# EAGLE schematic MotionDetectorCamera (EAGLE 9.6.2)

## Sheet 1 of 7: Power
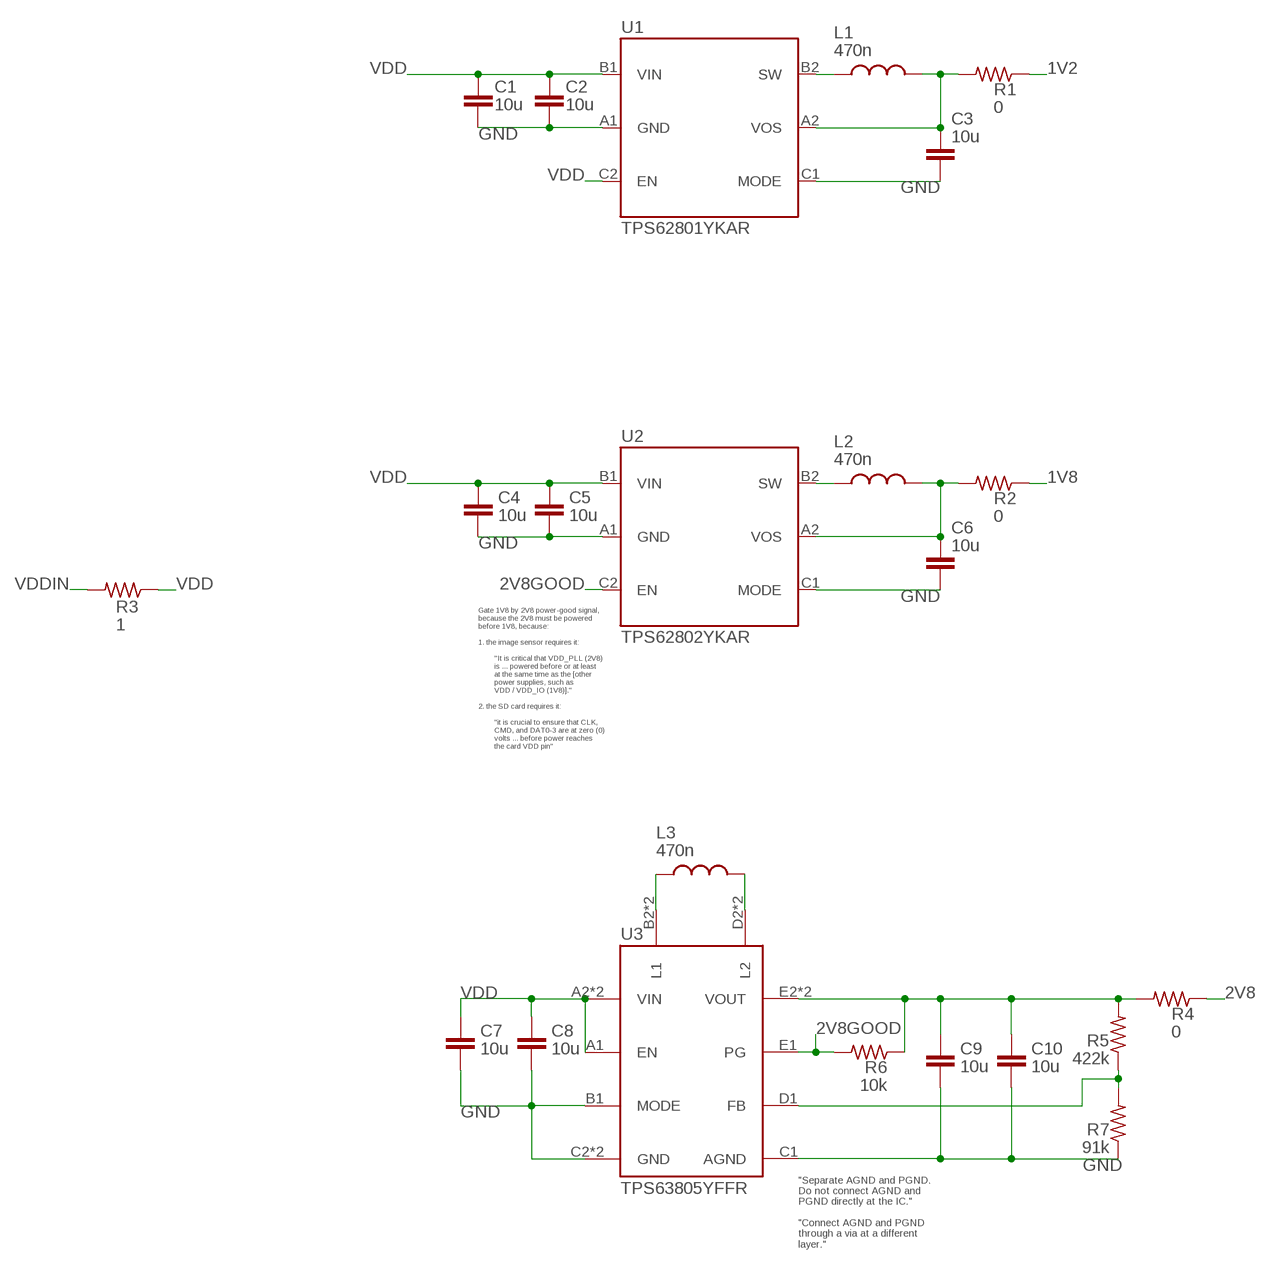
[diagram p0: schematic, sheet 1]

### Parts
C1  10u  CAPACITOR0805  [0805]
C2  10u  CAPACITOR0805  [0805]
C3  10u  CAPACITOR0805  [0805]
C4  10u  CAPACITOR0805  [0805]
C5  10u  CAPACITOR0805  [0805]
C6  10u  CAPACITOR0805  [0805]
C7  10u  CAPACITOR0805  [0805]
C8  10u  CAPACITOR0805  [0805]
C9  10u  CAPACITOR0805  [0805]
C10  10u  CAPACITOR0805  [0805]
L1  470n  INDUCTOR0806  [0806]
L2  470n  INDUCTOR0806  [0806]
L3  470n  INDUCTOR0806  [0806]
R1  0  RESISTOR0805  [0805]
R2  0  RESISTOR0805  [0805]
R3  1  RESISTOR1206  [1206]
R4  0  RESISTOR0805  [0805]
R5  422k  RESISTOR0402  [0402]
R6  10k  RESISTOR0402  [0402]
R7  91k  RESISTOR0402  [0402]
U1  TI-TPS6280XYKAR  [TI-TPS6280XYKAR]
U2  TI-TPS6280XYKAR  [TI-TPS6280XYKAR]
U3  TI-TPS63805YFFR  [TI-TPS63805YFFR]

### Nets
1V2: R1.1 ; also sheet 2
1V8: R2.1 ; also sheet 2,3,4,5,6
2V8: R4.1 ; also sheet 2,3,5
2V8GOOD: R6.2 U2.C2(EN) U3.E1(PG)
GND: C1.2 C2.2 C3.2 C4.2 C5.2 C6.2 C7.2 C8.2 C9.2 C10.2 R7.1 U1.A1(GND) U1.C1(MODE) U2.A1(GND) U2.C1(MODE) U3.B1(MODE) U3.C1(AGND) U3.C2(GND) U3.C3(GND) ; also sheet 2,3,4,5,6,7
N$4: L2.1 U2.B2(SW)
N$5: L1.1 U1.B2(SW)
N$8: C6.1 L2.2 R2.2 U2.A2(VOS)
N$11: R5.1 R7.2 U3.D1(FB)
N$12: L3.1 U3.B2(L1) U3.B3(L1)
N$13: L3.2 U3.D2(L2) U3.D3(L2)
N$16: C3.1 L1.2 R1.2 U1.A2(VOS)
N$18: C9.1 C10.1 R4.2 R5.2 R6.1 U3.E2(VOUT) U3.E3(VOUT)
VDD: C1.1 C2.1 C4.1 C5.1 C7.1 C8.1 R3.1 U1.B1(VIN) U1.C2(EN) U2.B1(VIN) U3.A1(EN) U3.A2(VIN) U3.A3(VIN)
VDDIN: R3.2 ; also sheet 6,7

### Notes on the sheet
- Gate 1V8 by 2V8 power-good signal,
  because the 2V8 must be powered
  before 1V8, because:
  
  1. the image sensor requires it:
  
          "It is critical that VDD_PLL (2V8)
          is ... powered before or at least
          at the same time as the [other
          power supplies, such as
          VDD / VDD_IO (1V8)]."
  
  2. the SD card requires it:
  
          "it is crucial to ensure that CLK,
          CMD, and DAT0-3 are at zero (0)
          volts ... before power reaches
          the card VDD pin"
- "Separate AGND and PGND.
  Do not connect AGND and
  PGND directly at the IC."
  
  "Connect AGND and PGND
  through a via at a different
  layer."

## Sheet 2 of 7: ICE40
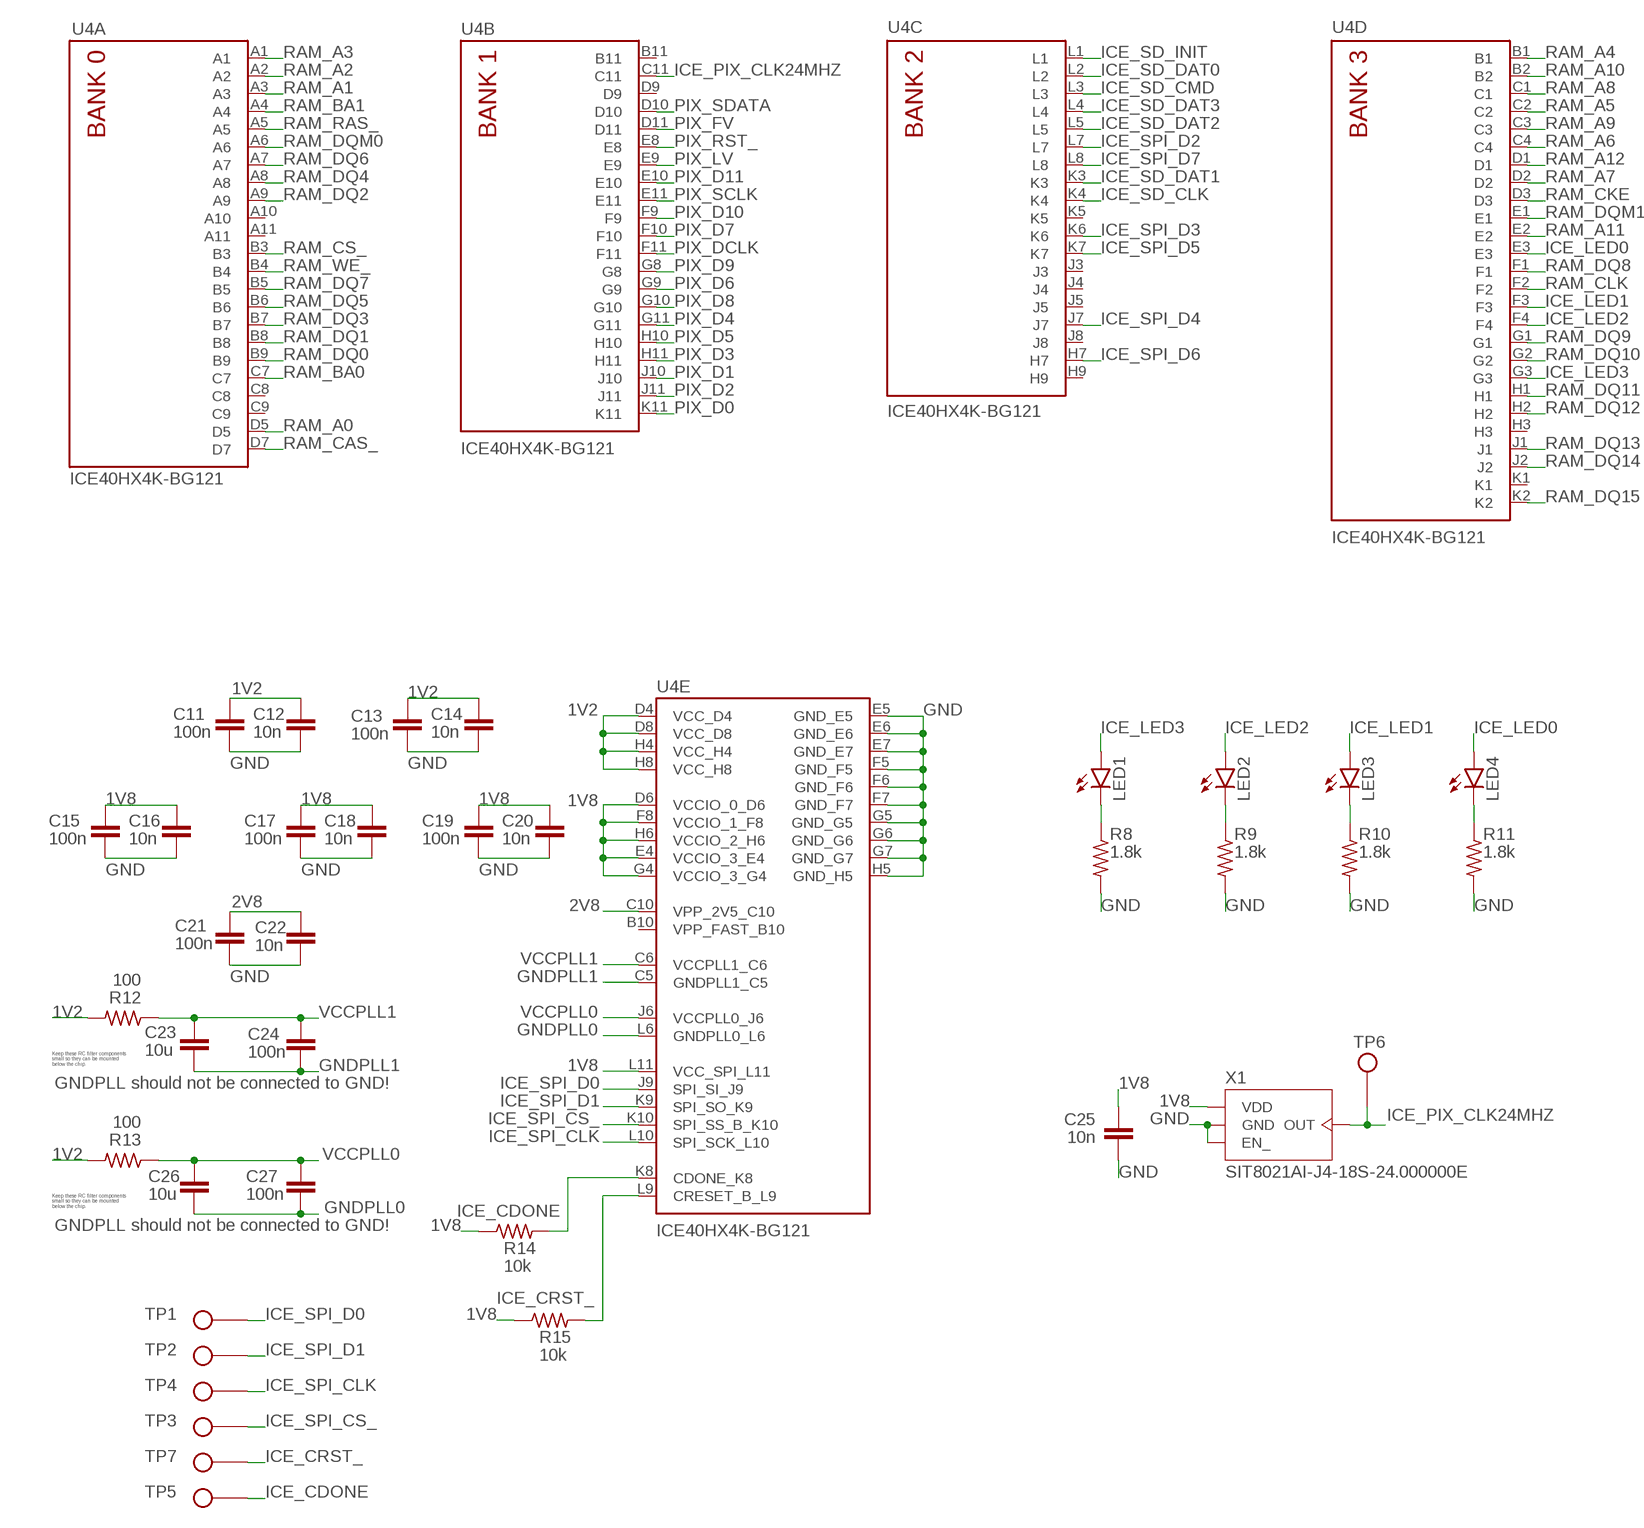
[diagram p1: schematic, sheet 2]

### Parts
C11  100n  CAPACITOR0402  [0402]
C12  10n  CAPACITOR0402  [0402]
C13  100n  CAPACITOR0402  [0402]
C14  10n  CAPACITOR0402  [0402]
C15  100n  CAPACITOR0402  [0402]
C16  10n  CAPACITOR0402  [0402]
C17  100n  CAPACITOR0402  [0402]
C18  10n  CAPACITOR0402  [0402]
C19  100n  CAPACITOR0402  [0402]
C20  10n  CAPACITOR0402  [0402]
C21  100n  CAPACITOR0402  [0402]
C22  10n  CAPACITOR0402  [0402]
C23  10u  CAPACITOR0805  [0805]
C24  100n  CAPACITOR0402  [0402]
C25  10n  CAPACITOR0402  [0402]
C26  10u  CAPACITOR0805  [0805]
C27  100n  CAPACITOR0402  [0402]
LED1  LED  [LED-0603]
LED2  LED  [LED-0603]
LED3  LED  [LED-0603]
LED4  LED  [LED-0603]
R8  1.8k  RESISTOR0402  [0402]
R9  1.8k  RESISTOR0402  [0402]
R10  1.8k  RESISTOR0402  [0402]
R11  1.8k  RESISTOR0402  [0402]
R12  100  RESISTOR0402  [0402]
R13  100  RESISTOR0402  [0402]
R14  10k  RESISTOR0402  [0402]
R15  10k  RESISTOR0402  [0402]
TP1  TEST-POINT  [TEST-POINT]
TP2  TEST-POINT  [TEST-POINT]
TP3  TEST-POINT  [TEST-POINT]
TP4  TEST-POINT  [TEST-POINT]
TP5  TEST-POINT  [TEST-POINT]
TP6  TEST-POINT  [TEST-POINT]
TP7  TEST-POINT  [TEST-POINT]
U4  LATTICE-ICE40HX4K-BG121  [LATTICE-ICE40HX4K-BG121]
X1  SITIME-SIT8021  [SITIME-SIT8021]

### Nets
1V2: C11.1 C12.1 C13.1 C14.1 R12.2 R13.2 U4.D4(E:VCC_D4) U4.D8(E:VCC_D8) U4.H4(E:VCC_H4) U4.H8(E:VCC_H8) ; also sheet 1
1V8: C15.1 C16.1 C17.1 C18.1 C19.1 C20.1 C25.1 R14.1 R15.1 U4.D6(E:VCCIO_0_D6) U4.E4(E:VCCIO_3_E4) U4.F8(E:VCCIO_1_F8) U4.G4(E:VCCIO_3_G4) U4.H6(E:VCCIO_2_H6) U4.L11(E:VCC_SPI_L11) X1.3(VDD) ; also sheet 1,3,4,5,6
2V8: C21.1 C22.1 U4.C10(E:VPP_2V5_C10) ; also sheet 1,3,5
GND: C11.2 C12.2 C13.2 C14.2 C15.2 C16.2 C17.2 C18.2 C19.2 C20.2 C21.2 C22.2 C25.2 R8.2 R9.2 R10.2 R11.2 U4.E5(E:GND_E5) U4.E6(E:GND_E6) U4.E7(E:GND_E7) U4.F5(E:GND_F5) U4.F6(E:GND_F6) U4.F7(E:GND_F7) U4.G5(E:GND_G5) U4.G6(E:GND_G6) U4.G7(E:GND_G7) U4.H5(E:GND_H5) X1.1(EN_) X1.4(GND) ; also sheet 1,3,4,5,6,7
GNDPLL0: C26.2 C27.2 U4.L6(E:GNDPLL0_L6)
GNDPLL1: C23.2 C24.2 U4.C5(E:GNDPLL1_C5)
ICE_CDONE: R14.2 TP5.X U4.K8(E:CDONE_K8) ; also sheet 6
ICE_CRST_: R15.2 TP7.X U4.L9(E:CRESET_B_L9) ; also sheet 6
ICE_LED0: LED4.A U4.E3(D:E3)
ICE_LED1: LED3.A U4.F3(D:F3)
ICE_LED2: LED2.A U4.F4(D:F4)
ICE_LED3: LED1.A U4.G3(D:G3)
ICE_PIX_CLK24MHZ: TP6.X U4.C11(B:C11) X1.2(OUT) ; also sheet 3
ICE_SD_CLK: U4.K4(C:K4) ; also sheet 5
ICE_SD_CMD: U4.L3(C:L3) ; also sheet 5
ICE_SD_DAT0: U4.L2(C:L2) ; also sheet 5
ICE_SD_DAT1: U4.K3(C:K3) ; also sheet 5
ICE_SD_DAT2: U4.L5(C:L5) ; also sheet 5
ICE_SD_DAT3: U4.L4(C:L4) ; also sheet 5
ICE_SD_INIT: U4.L1(C:L1) ; also sheet 5
ICE_SPI_CLK: TP4.X U4.L10(E:SPI_SCK_L10) ; also sheet 6
ICE_SPI_CS_: TP3.X U4.K10(E:SPI_SS_B_K10) ; also sheet 6
ICE_SPI_D0: TP1.X U4.J9(E:SPI_SI_J9) ; also sheet 6
ICE_SPI_D1: TP2.X U4.K9(E:SPI_SO_K9) ; also sheet 6
ICE_SPI_D2: U4.L7(C:L7) ; also sheet 6
ICE_SPI_D3: U4.K6(C:K6) ; also sheet 6
ICE_SPI_D4: U4.J7(C:J7) ; also sheet 6
ICE_SPI_D5: U4.K7(C:K7) ; also sheet 6
ICE_SPI_D6: U4.H7(C:H7) ; also sheet 6
ICE_SPI_D7: U4.L8(C:L8) ; also sheet 6
N$23: LED4.C R11.1
N$26: LED3.C R10.1
N$29: LED2.C R9.1
N$31: LED1.C R8.1
PIX_D0: U4.K11(B:K11) ; also sheet 3
PIX_D1: U4.J10(B:J10) ; also sheet 3
PIX_D2: U4.J11(B:J11) ; also sheet 3
PIX_D3: U4.H11(B:H11) ; also sheet 3
PIX_D4: U4.G11(B:G11) ; also sheet 3
PIX_D5: U4.H10(B:H10) ; also sheet 3
PIX_D6: U4.G9(B:G9) ; also sheet 3
PIX_D7: U4.F10(B:F10) ; also sheet 3
PIX_D8: U4.G10(B:G10) ; also sheet 3
PIX_D9: U4.G8(B:G8) ; also sheet 3
PIX_D10: U4.F9(B:F9) ; also sheet 3
PIX_D11: U4.E10(B:E10) ; also sheet 3
PIX_DCLK: U4.F11(B:F11) ; also sheet 3
PIX_FV: U4.D11(B:D11) ; also sheet 3
PIX_LV: U4.E9(B:E9) ; also sheet 3
PIX_RST_: U4.E8(B:E8) ; also sheet 3
PIX_SCLK: U4.E11(B:E11) ; also sheet 3
PIX_SDATA: U4.D10(B:D10) ; also sheet 3
RAM_A0: U4.D5(A:D5) ; also sheet 4
RAM_A1: U4.A3(A:A3) ; also sheet 4
RAM_A2: U4.A2(A:A2) ; also sheet 4
RAM_A3: U4.A1(A:A1) ; also sheet 4
RAM_A4: U4.B1(D:B1) ; also sheet 4
RAM_A5: U4.C2(D:C2) ; also sheet 4
RAM_A6: U4.C4(D:C4) ; also sheet 4
RAM_A7: U4.D2(D:D2) ; also sheet 4
RAM_A8: U4.C1(D:C1) ; also sheet 4
RAM_A9: U4.C3(D:C3) ; also sheet 4
RAM_A10: U4.B2(D:B2) ; also sheet 4
RAM_A11: U4.E2(D:E2) ; also sheet 4
RAM_A12: U4.D1(D:D1) ; also sheet 4
RAM_BA0: U4.C7(A:C7) ; also sheet 4
RAM_BA1: U4.A4(A:A4) ; also sheet 4
RAM_CAS_: U4.D7(A:D7) ; also sheet 4
RAM_CKE: U4.D3(D:D3) ; also sheet 4
RAM_CLK: U4.F2(D:F2) ; also sheet 4
RAM_CS_: U4.B3(A:B3) ; also sheet 4
RAM_DQ0: U4.B9(A:B9) ; also sheet 4
RAM_DQ1: U4.B8(A:B8) ; also sheet 4
RAM_DQ2: U4.A9(A:A9) ; also sheet 4
RAM_DQ3: U4.B7(A:B7) ; also sheet 4
RAM_DQ4: U4.A8(A:A8) ; also sheet 4
RAM_DQ5: U4.B6(A:B6) ; also sheet 4
RAM_DQ6: U4.A7(A:A7) ; also sheet 4
RAM_DQ7: U4.B5(A:B5) ; also sheet 4
RAM_DQ8: U4.F1(D:F1) ; also sheet 4
RAM_DQ9: U4.G1(D:G1) ; also sheet 4
RAM_DQ10: U4.G2(D:G2) ; also sheet 4
RAM_DQ11: U4.H1(D:H1) ; also sheet 4
RAM_DQ12: U4.H2(D:H2) ; also sheet 4
RAM_DQ13: U4.J1(D:J1) ; also sheet 4
RAM_DQ14: U4.J2(D:J2) ; also sheet 4
RAM_DQ15: U4.K2(D:K2) ; also sheet 4
RAM_DQM0: U4.A6(A:A6) ; also sheet 4
RAM_DQM1: U4.E1(D:E1) ; also sheet 4
RAM_RAS_: U4.A5(A:A5) ; also sheet 4
RAM_WE_: U4.B4(A:B4) ; also sheet 4
VCCPLL0: C26.1 C27.1 R13.1 U4.J6(E:VCCPLL0_J6)
VCCPLL1: C23.1 C24.1 R12.1 U4.C6(E:VCCPLL1_C6)
Unconnected: U4.A10(A:A10) U4.A11(A:A11) U4.B10(E:VPP_FAST_B10) U4.B11(B:B11) U4.C8(A:C8) U4.C9(A:C9) U4.D9(B:D9) U4.H3(D:H3) U4.H9(C:H9) U4.J3(C:J3) U4.J4(C:J4) U4.J5(C:J5) U4.J8(C:J8) U4.K1(D:K1) U4.K5(C:K5)

### Notes on the sheet
- Keep these RC filter components
  small so they can be mounted
  below the chip.
- GNDPLL should not be connected to GND!
- Keep these RC filter components
  small so they can be mounted
  below the chip.
- GNDPLL should not be connected to GND!

## Sheet 3 of 7: Image Sensor
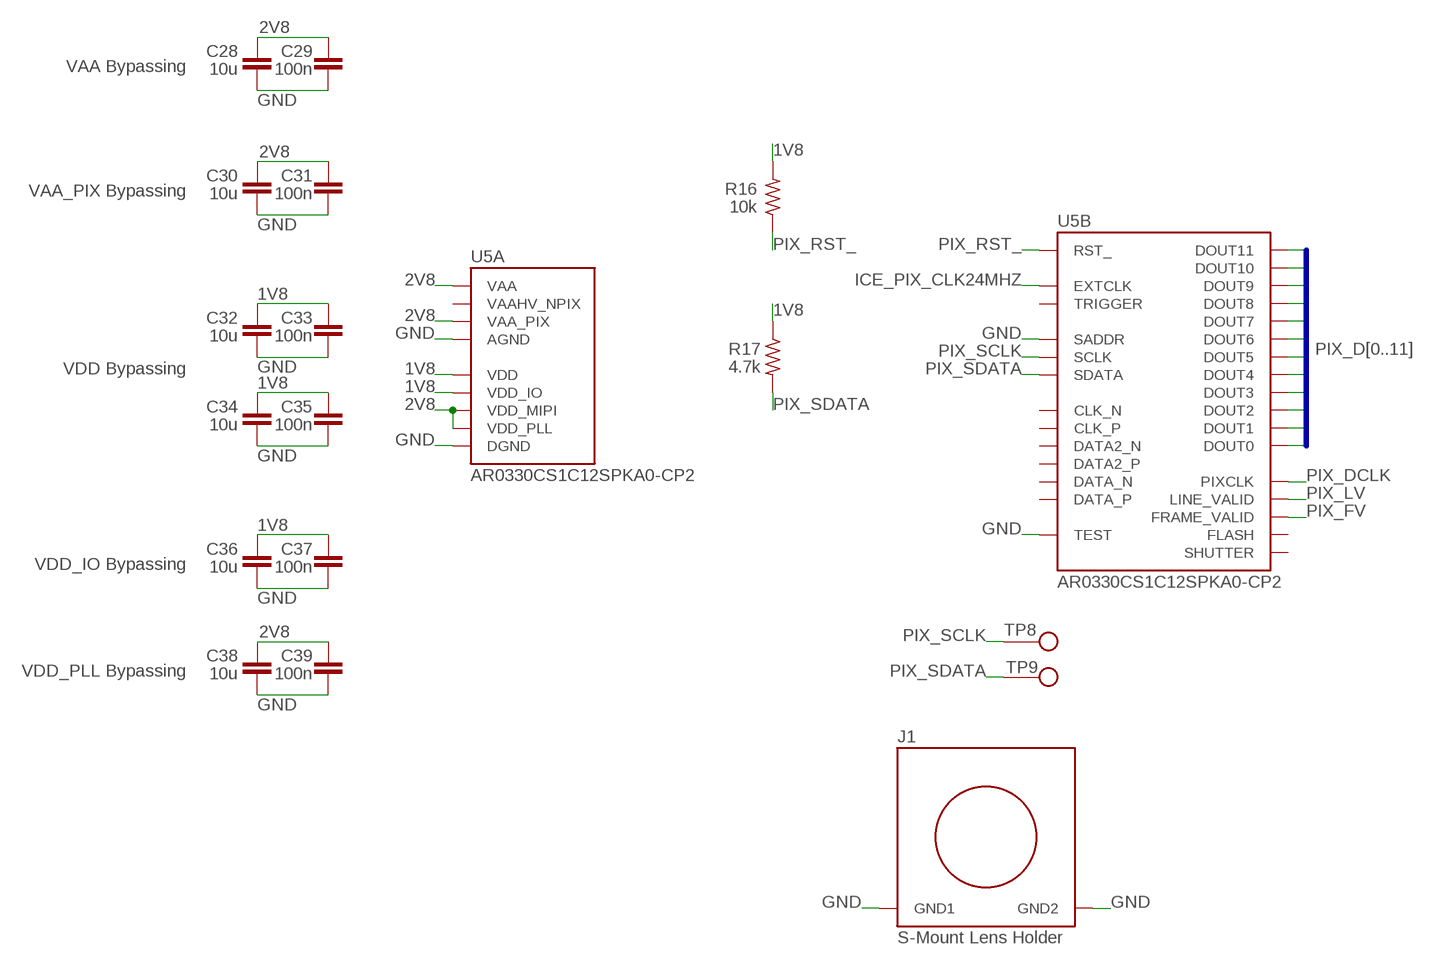
[diagram p2: schematic, sheet 3]

### Parts
C28  10u  CAPACITOR0805  [0805]
C29  100n  CAPACITOR0402  [0402]
C30  10u  CAPACITOR0805  [0805]
C31  100n  CAPACITOR0402  [0402]
C32  10u  CAPACITOR0805  [0805]
C33  100n  CAPACITOR0402  [0402]
C34  10u  CAPACITOR0805  [0805]
C35  100n  CAPACITOR0402  [0402]
C36  10u  CAPACITOR0805  [0805]
C37  100n  CAPACITOR0402  [0402]
C38  10u  CAPACITOR0805  [0805]
C39  100n  CAPACITOR0402  [0402]
J1  S-MOUNT-LENS-HOLDER  [S-MOUNT-LENS-HOLDER]
R16  10k  RESISTOR0402  [0402]
R17  4.7k  RESISTOR0402  [0402]
TP8  TEST-POINT  [TEST-POINT]
TP9  TEST-POINT  [TEST-POINT]
U5  ON-AR0330CS1C12SPKA0  [ON-AR0330CS1C12SPKA0]

### Nets
1V8: C32.1 C33.1 C34.1 C35.1 C36.1 C37.1 R16.2 R17.1 U5.A7(A:VDD_IO) U5.A8(A:VDD) U5.B1(A:VDD) U5.D2(A:VDD_IO) U5.D5(A:VDD_IO) U5.D6(A:VDD_IO) U5.E5(A:VDD_IO) U5.F6(A:VDD_IO) U5.G2(A:VDD) U5.G8(A:VDD) U5.H5(A:VDD_IO) ; also sheet 1,2,4,5,6
2V8: C28.1 C29.1 C30.1 C31.1 C38.1 C39.1 U5.A1(A:VAA) U5.A5(A:VAA_PIX) U5.A6(A:VAA) U5.F8(A:VDD_PLL) U5.H6(A:VDD_MIPI) U5.H8(A:VDD_MIPI) ; also sheet 1,2,5
GND: C28.2 C29.2 C30.2 C31.2 C32.2 C33.2 C34.2 C35.2 C36.2 C37.2 C38.2 C39.2 J1.1(GND1) J1.2(GND2) U5.A3(A:AGND) U5.B4(A:DGND) U5.B5(A:AGND) U5.B6(A:DGND) U5.B7(B:TEST) U5.C1(B:SADDR) U5.C4(A:DGND) U5.C5(A:DGND) U5.C6(A:DGND) U5.D4(A:DGND) U5.E6(A:DGND) U5.G1(A:DGND) U5.H2(A:DGND) U5.H3(A:DGND) ; also sheet 1,2,4,5,6,7
ICE_PIX_CLK24MHZ: U5.D7(B:EXTCLK) ; also sheet 2
PIX_D0: U5.G6(B:DOUT0) ; also sheet 2
PIX_D1: U5.G5(B:DOUT1) ; also sheet 2
PIX_D2: U5.H4(B:DOUT2) ; also sheet 2
PIX_D3: U5.G4(B:DOUT3) ; also sheet 2
PIX_D4: U5.F5(B:DOUT4) ; also sheet 2
PIX_D5: U5.G3(B:DOUT5) ; also sheet 2
PIX_D6: U5.F4(B:DOUT6) ; also sheet 2
PIX_D7: U5.E4(B:DOUT7) ; also sheet 2
PIX_D8: U5.F3(B:DOUT8) ; also sheet 2
PIX_D9: U5.E3(B:DOUT9) ; also sheet 2
PIX_D10: U5.D3(B:DOUT10) ; also sheet 2
PIX_D11: U5.E2(B:DOUT11) ; also sheet 2
PIX_DCLK: U5.E1(B:PIXCLK) ; also sheet 2
PIX_FV: U5.B3(B:FRAME_VALID) ; also sheet 2
PIX_LV: U5.C3(B:LINE_VALID) ; also sheet 2
PIX_RST_: R16.1 U5.C8(B:RST_) ; also sheet 2
PIX_SCLK: TP8.X U5.D1(B:SCLK) ; also sheet 2
PIX_SDATA: R17.2 TP9.X U5.B2(B:SDATA) ; also sheet 2
Unconnected: U5.A2(A:VAAHV_NPIX) U5.B8(B:SHUTTER) U5.C2(B:FLASH) U5.C7(B:TRIGGER) U5.D8(B:DATA_N) U5.E7(B:CLK_N) U5.E8(B:DATA_P) U5.F7(B:CLK_P) U5.G7(B:DATA2_N) U5.H7(B:DATA2_P)

### Buses
PIX_D[0..11]

### Notes on the sheet
- VAA Bypassing
- VAA_PIX Bypassing
- VDD Bypassing
- VDD_IO Bypassing
- VDD_PLL Bypassing

## Sheet 4 of 7: RAM
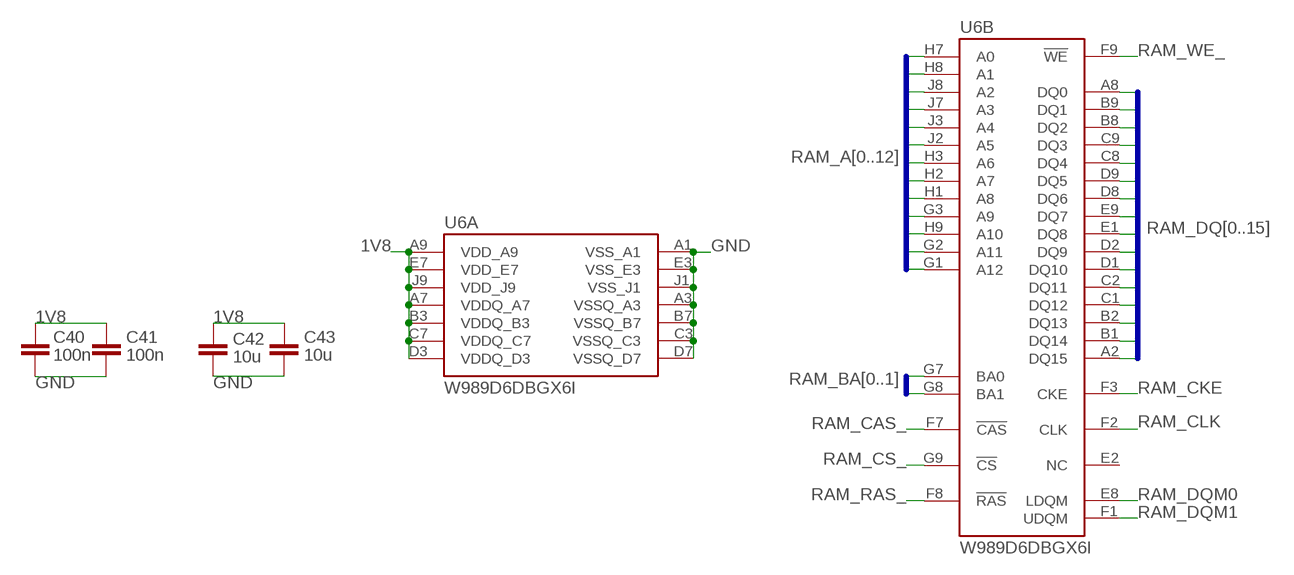
[diagram p3: schematic, sheet 4]

### Parts
C40  100n  CAPACITOR0402  [0402]
C41  100n  CAPACITOR0402  [0402]
C42  10u  CAPACITOR0805  [0805]
C43  10u  CAPACITOR0805  [0805]
U6  W989D6DBGX6I  [W989D6DBGX6I]

### Nets
1V8: C40.1 C41.1 C42.1 C43.1 U6.A7(A:VDDQ_A7) U6.A9(A:VDD_A9) U6.B3(A:VDDQ_B3) U6.C7(A:VDDQ_C7) U6.D3(A:VDDQ_D3) U6.E7(A:VDD_E7) U6.J9(A:VDD_J9) ; also sheet 1,2,3,5,6
GND: C40.2 C41.2 C42.2 C43.2 U6.A1(A:VSS_A1) U6.A3(A:VSSQ_A3) U6.B7(A:VSSQ_B7) U6.C3(A:VSSQ_C3) U6.D7(A:VSSQ_D7) U6.E3(A:VSS_E3) U6.J1(A:VSS_J1) ; also sheet 1,2,3,5,6,7
RAM_A0: U6.H7(B:A0) ; also sheet 2
RAM_A1: U6.H8(B:A1) ; also sheet 2
RAM_A2: U6.J8(B:A2) ; also sheet 2
RAM_A3: U6.J7(B:A3) ; also sheet 2
RAM_A4: U6.J3(B:A4) ; also sheet 2
RAM_A5: U6.J2(B:A5) ; also sheet 2
RAM_A6: U6.H3(B:A6) ; also sheet 2
RAM_A7: U6.H2(B:A7) ; also sheet 2
RAM_A8: U6.H1(B:A8) ; also sheet 2
RAM_A9: U6.G3(B:A9) ; also sheet 2
RAM_A10: U6.H9(B:A10) ; also sheet 2
RAM_A11: U6.G2(B:A11) ; also sheet 2
RAM_A12: U6.G1(B:A12) ; also sheet 2
RAM_BA0: U6.G7(B:BA0) ; also sheet 2
RAM_BA1: U6.G8(B:BA1) ; also sheet 2
RAM_CAS_: U6.F7(B:!CAS!) ; also sheet 2
RAM_CKE: U6.F3(B:CKE) ; also sheet 2
RAM_CLK: U6.F2(B:CLK) ; also sheet 2
RAM_CS_: U6.G9(B:!CS!) ; also sheet 2
RAM_DQ0: U6.A8(B:DQ0) ; also sheet 2
RAM_DQ1: U6.B9(B:DQ1) ; also sheet 2
RAM_DQ2: U6.B8(B:DQ2) ; also sheet 2
RAM_DQ3: U6.C9(B:DQ3) ; also sheet 2
RAM_DQ4: U6.C8(B:DQ4) ; also sheet 2
RAM_DQ5: U6.D9(B:DQ5) ; also sheet 2
RAM_DQ6: U6.D8(B:DQ6) ; also sheet 2
RAM_DQ7: U6.E9(B:DQ7) ; also sheet 2
RAM_DQ8: U6.E1(B:DQ8) ; also sheet 2
RAM_DQ9: U6.D2(B:DQ9) ; also sheet 2
RAM_DQ10: U6.D1(B:DQ10) ; also sheet 2
RAM_DQ11: U6.C2(B:DQ11) ; also sheet 2
RAM_DQ12: U6.C1(B:DQ12) ; also sheet 2
RAM_DQ13: U6.B2(B:DQ13) ; also sheet 2
RAM_DQ14: U6.B1(B:DQ14) ; also sheet 2
RAM_DQ15: U6.A2(B:DQ15) ; also sheet 2
RAM_DQM0: U6.E8(B:LDQM) ; also sheet 2
RAM_DQM1: U6.F1(B:UDQM) ; also sheet 2
RAM_RAS_: U6.F8(B:!RAS!) ; also sheet 2
RAM_WE_: U6.F9(B:!WE!) ; also sheet 2
Unconnected: U6.E2(B:NC)

### Buses
RAM_A[0..12]
RAM_DQ[0..15]
RAM_BA[0..1]

## Sheet 5 of 7: SD Card
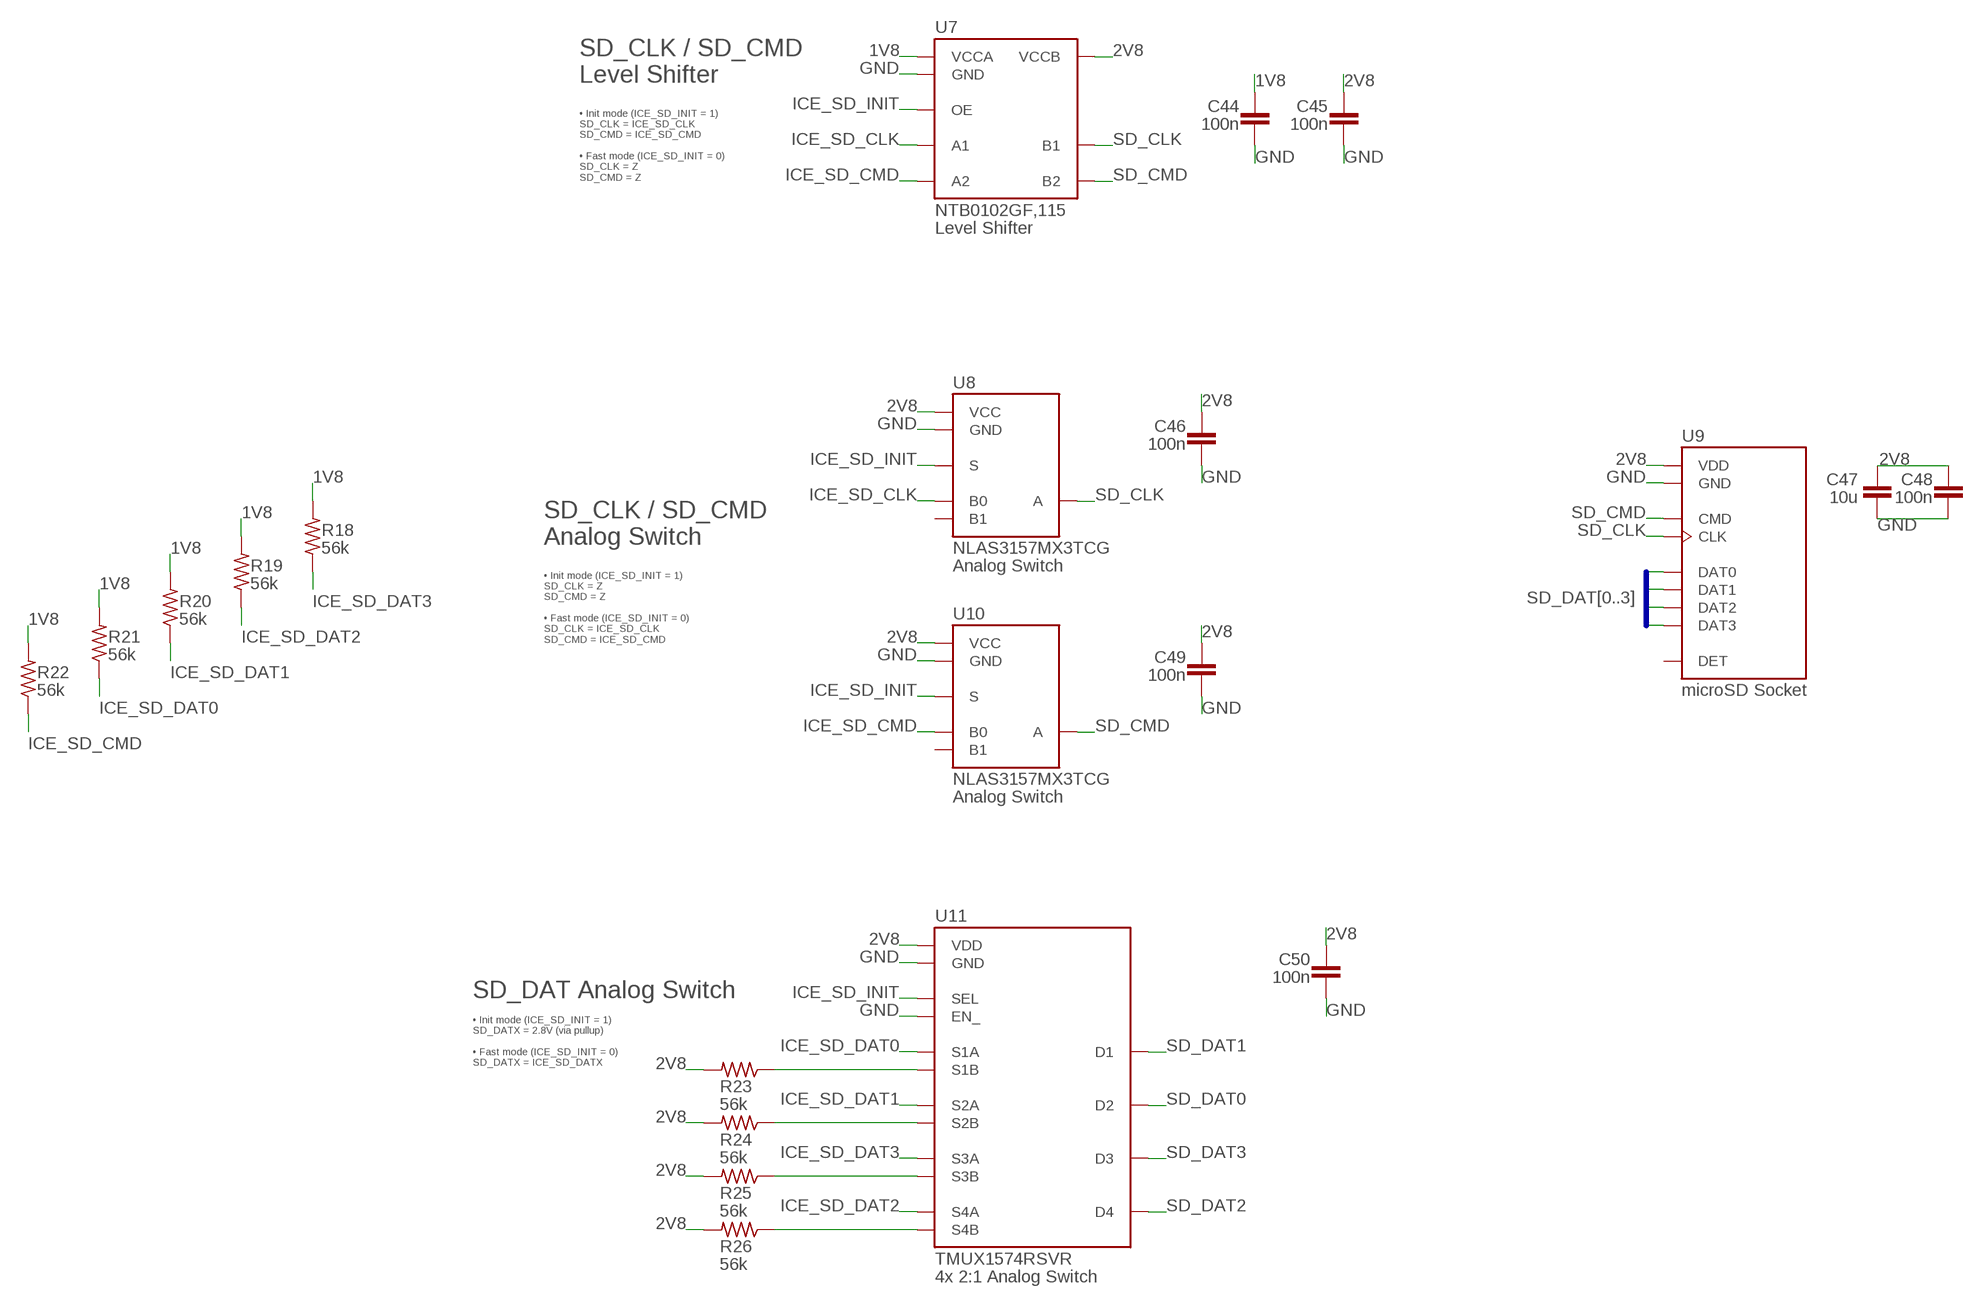
[diagram p4: schematic, sheet 5]

### Parts
C44  100n  CAPACITOR0402  [0402]
C45  100n  CAPACITOR0402  [0402]
C46  100n  CAPACITOR0402  [0402]
C47  10u  CAPACITOR0805  [0805]
C48  100n  CAPACITOR0402  [0402]
C49  100n  CAPACITOR0402  [0402]
C50  100n  CAPACITOR0402  [0402]
R18  56k  RESISTOR0402  [0402]
R19  56k  RESISTOR0402  [0402]
R20  56k  RESISTOR0402  [0402]
R21  56k  RESISTOR0402  [0402]
R22  56k  RESISTOR0402  [0402]
R23  56k  RESISTOR0402  [0402]
R24  56k  RESISTOR0402  [0402]
R25  56k  RESISTOR0402  [0402]
R26  56k  RESISTOR0402  [0402]
U7  NXP-NTB0102  [NXP-NTB0102GF]
U8  ON-NLAS3157  [ON-NLAS3157MX3TCG]
U9  MICROSD-SOCKET  [MOLEX-1051620001]
U10  ON-NLAS3157  [ON-NLAS3157MX3TCG]
U11  TI-TMUX1574  [TI-TMUX1574RSVR]

### Nets
1V8: C44.1 R18.2 R19.2 R20.2 R21.2 R22.2 U7.3(VCCA) ; also sheet 1,2,3,4,6
2V8: C45.1 C46.1 C47.1 C48.1 C49.1 C50.1 R23.2 R24.2 R25.2 R26.2 U7.7(VCCB) U8.1(VCC) U9.VDD U10.1(VCC) U11.14(VDD) ; also sheet 1,2,3
GND: C44.2 C45.2 C46.2 C47.2 C48.2 C49.2 C50.2 U7.2(GND) U8.5(GND) U9.GND1(GND) U9.GND2(GND) U9.GND3(GND) U9.GND4(GND) U9.VSS(GND) U10.5(GND) U11.6(GND) U11.13(EN_) ; also sheet 1,2,3,4,6,7
ICE_SD_CLK: U7.5(A1) U8.4(B0) ; also sheet 2
ICE_SD_CMD: R22.1 U7.4(A2) U10.4(B0) ; also sheet 2
ICE_SD_DAT0: R21.1 U11.16(S1A) ; also sheet 2
ICE_SD_DAT1: R20.1 U11.3(S2A) ; also sheet 2
ICE_SD_DAT2: R19.1 U11.12(S4A) ; also sheet 2
ICE_SD_DAT3: R18.1 U11.9(S3A) ; also sheet 2
ICE_SD_INIT: U7.6(OE) U8.6(S) U10.6(S) U11.15(SEL) ; also sheet 2
N$6: R23.1 U11.1(S1B)
N$14: R24.1 U11.4(S2B)
N$17: R26.1 U11.11(S4B)
N$21: R25.1 U11.8(S3B)
SD_CLK: U7.8(B1) U8.3(A) U9.CLK
SD_CMD: U7.1(B2) U9.CMD U10.3(A)
SD_DAT0: U9.DAT0 U11.5(D2)
SD_DAT1: U9.DAT1 U11.2(D1)
SD_DAT2: U9.DAT2 U11.10(D4)
SD_DAT3: U9.DAT3 U11.7(D3)
Unconnected: U8.2(B1) U9.DET U10.2(B1)

### Buses
SD_DAT[0..3]

### Notes on the sheet
- SD_CLK / SD_CMD
  Level Shifter
- • Init mode (ICE_SD_INIT = 1) 
  SD_CLK = ICE_SD_CLK
  SD_CMD = ICE_SD_CMD
  
  • Fast mode (ICE_SD_INIT = 0)
  SD_CLK = Z
  SD_CMD = Z
- SD_CLK / SD_CMD
  Analog Switch
- • Init mode (ICE_SD_INIT = 1) 
  SD_CLK = Z
  SD_CMD = Z
  
  • Fast mode (ICE_SD_INIT = 0)
  SD_CLK = ICE_SD_CLK
  SD_CMD = ICE_SD_CMD
- SD_DAT Analog Switch
- • Init mode (ICE_SD_INIT = 1)
  SD_DATX = 2.8V (via pullup)
  
  • Fast mode (ICE_SD_INIT = 0)
  SD_DATX = ICE_SD_DATX

## Sheet 6 of 7: STM32
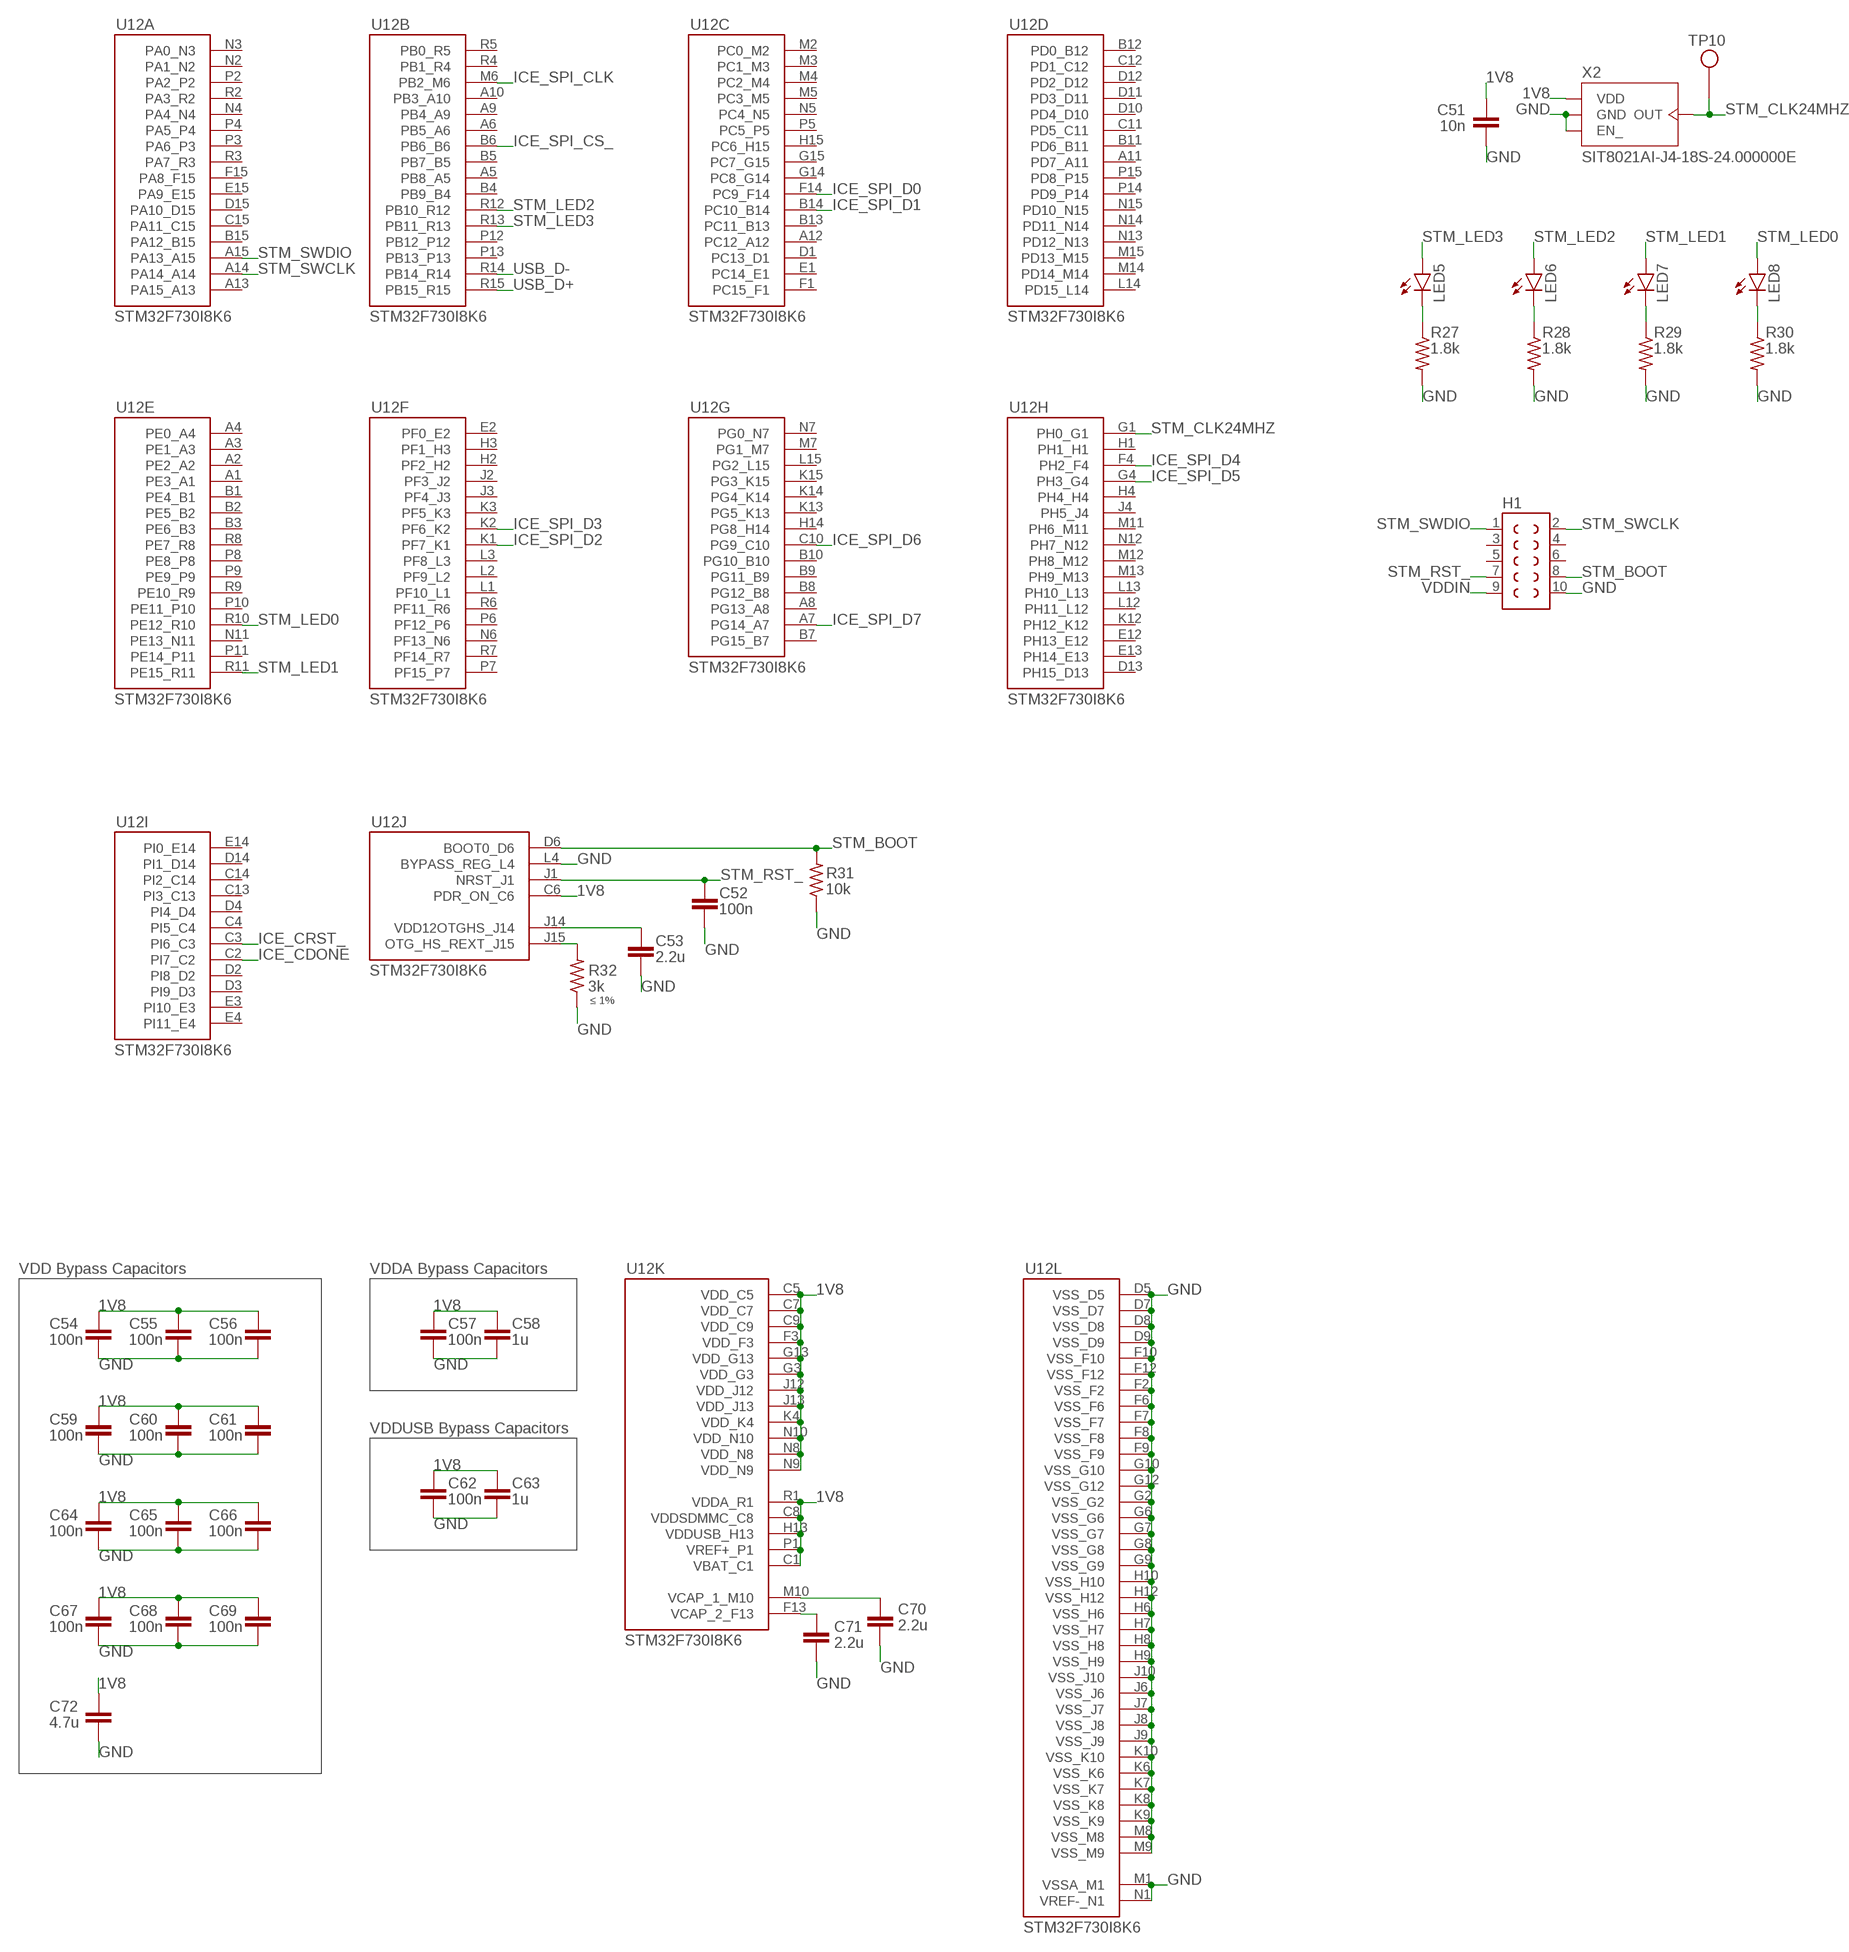
[diagram p5: schematic, sheet 6]

### Parts
C51  10n  CAPACITOR0402  [0402]
C52  100n  CAPACITOR0402  [0402]
C53  2.2u  CAPACITOR0402  [0402]
C54  100n  CAPACITOR0402  [0402]
C55  100n  CAPACITOR0402  [0402]
C56  100n  CAPACITOR0402  [0402]
C57  100n  CAPACITOR0402  [0402]
C58  1u  CAPACITOR0402  [0402]
C59  100n  CAPACITOR0402  [0402]
C60  100n  CAPACITOR0402  [0402]
C61  100n  CAPACITOR0402  [0402]
C62  100n  CAPACITOR0402  [0402]
C63  1u  CAPACITOR0402  [0402]
C64  100n  CAPACITOR0402  [0402]
C65  100n  CAPACITOR0402  [0402]
C66  100n  CAPACITOR0402  [0402]
C67  100n  CAPACITOR0402  [0402]
C68  100n  CAPACITOR0402  [0402]
C69  100n  CAPACITOR0402  [0402]
C70  2.2u  CAPACITOR0402  [0402]
C71  2.2u  CAPACITOR0402  [0402]
C72  4.7u  CAPACITOR0603  [0603]
H1  HEADER-2X5  [TEC-1-2314844-0]
LED5  LED  [LED-0603]
LED6  LED  [LED-0603]
LED7  LED  [LED-0603]
LED8  LED  [LED-0603]
R27  1.8k  RESISTOR0402  [0402]
R28  1.8k  RESISTOR0402  [0402]
R29  1.8k  RESISTOR0402  [0402]
R30  1.8k  RESISTOR0402  [0402]
R31  10k  RESISTOR0402  [0402]
R32  3k  RESISTOR0402  [0402]
TP10  TEST-POINT  [TEST-POINT]
U12  STM-STM32F730  [STM-STM32F730I8]
X2  SITIME-SIT8021  [SITIME-SIT8021]

### Nets
1V8: C51.1 C54.1 C55.1 C56.1 C57.1 C58.1 C59.1 C60.1 C61.1 C62.1 C63.1 C64.1 C65.1 C66.1 C67.1 C68.1 C69.1 C72.1 U12.C1(K:VBAT_C1) U12.C5(K:VDD_C5) U12.C6(J:PDR_ON_C6) U12.C7(K:VDD_C7) U12.C8(K:VDDSDMMC_C8) U12.C9(K:VDD_C9) U12.F3(K:VDD_F3) U12.G3(K:VDD_G3) U12.G13(K:VDD_G13) U12.H13(K:VDDUSB_H13) U12.J12(K:VDD_J12) U12.J13(K:VDD_J13) U12.K4(K:VDD_K4) U12.N8(K:VDD_N8) U12.N9(K:VDD_N9) U12.N10(K:VDD_N10) U12.P1(K:VREF+_P1) U12.R1(K:VDDA_R1) X2.3(VDD) ; also sheet 1,2,3,4,5
GND: C51.2 C52.2 C53.2 C54.2 C55.2 C56.2 C57.2 C58.2 C59.2 C60.2 C61.2 C62.2 C63.2 C64.2 C65.2 C66.2 C67.2 C68.2 C69.2 C70.2 C71.2 C72.2 H1.10 R27.2 R28.2 R29.2 R30.2 R31.1 R32.1 U12.D5(L:VSS_D5) U12.D7(L:VSS_D7) U12.D8(L:VSS_D8) U12.D9(L:VSS_D9) U12.F2(L:VSS_F2) U12.F6(L:VSS_F6) U12.F7(L:VSS_F7) U12.F8(L:VSS_F8) U12.F9(L:VSS_F9) U12.F10(L:VSS_F10) U12.F12(L:VSS_F12) U12.G2(L:VSS_G2) U12.G6(L:VSS_G6) U12.G7(L:VSS_G7) U12.G8(L:VSS_G8) U12.G9(L:VSS_G9) U12.G10(L:VSS_G10) U12.G12(L:VSS_G12) U12.H6(L:VSS_H6) U12.H7(L:VSS_H7) U12.H8(L:VSS_H8) U12.H9(L:VSS_H9) U12.H10(L:VSS_H10) U12.H12(L:VSS_H12) U12.J6(L:VSS_J6) U12.J7(L:VSS_J7) U12.J8(L:VSS_J8) U12.J9(L:VSS_J9) U12.J10(L:VSS_J10) U12.K6(L:VSS_K6) U12.K7(L:VSS_K7) U12.K8(L:VSS_K8) U12.K9(L:VSS_K9) U12.K10(L:VSS_K10) U12.L4(J:BYPASS_REG_L4) U12.M1(L:VSSA_M1) U12.M8(L:VSS_M8) U12.M9(L:VSS_M9) U12.N1(L:VREF-_N1) X2.1(EN_) X2.4(GND) ; also sheet 1,2,3,4,5,7
ICE_CDONE: U12.C2(I:PI7_C2) ; also sheet 2
ICE_CRST_: U12.C3(I:PI6_C3) ; also sheet 2
ICE_SPI_CLK: U12.M6(B:PB2_M6) ; also sheet 2
ICE_SPI_CS_: U12.B6(B:PB6_B6) ; also sheet 2
ICE_SPI_D0: U12.F14(C:PC9_F14) ; also sheet 2
ICE_SPI_D1: U12.B14(C:PC10_B14) ; also sheet 2
ICE_SPI_D2: U12.K1(F:PF7_K1) ; also sheet 2
ICE_SPI_D3: U12.K2(F:PF6_K2) ; also sheet 2
ICE_SPI_D4: U12.F4(H:PH2_F4) ; also sheet 2
ICE_SPI_D5: U12.G4(H:PH3_G4) ; also sheet 2
ICE_SPI_D6: U12.C10(G:PG9_C10) ; also sheet 2
ICE_SPI_D7: U12.A7(G:PG14_A7) ; also sheet 2
N$1: LED5.C R27.1
N$2: C70.1 U12.M10(K:VCAP_1_M10)
N$3: LED6.C R28.1
N$7: C71.1 U12.F13(K:VCAP_2_F13)
N$10: R32.2 U12.J15(J:OTG_HS_REXT_J15)
N$20: LED7.C R29.1
N$25: C53.1 U12.J14(J:VDD12OTGHS_J14)
N$27: LED8.C R30.1
STM_BOOT: H1.8 R31.2 U12.D6(J:BOOT0_D6)
STM_CLK24MHZ: TP10.X U12.G1(H:PH0_G1) X2.2(OUT)
STM_LED0: LED8.A U12.R10(E:PE12_R10)
STM_LED1: LED7.A U12.R11(E:PE15_R11)
STM_LED2: LED6.A U12.R12(B:PB10_R12)
STM_LED3: LED5.A U12.R13(B:PB11_R13)
STM_RST_: C52.1 H1.7 U12.J1(J:NRST_J1)
STM_SWCLK: H1.2 U12.A14(A:PA14_A14)
STM_SWDIO: H1.1 U12.A15(A:PA13_A15)
USB_D+: U12.R15(B:PB15_R15) ; also sheet 7
USB_D-: U12.R14(B:PB14_R14) ; also sheet 7
VDDIN: H1.9 ; also sheet 1,7
Unconnected: H1.3 H1.4 H1.5 H1.6 U12.A1(E:PE3_A1) U12.A2(E:PE2_A2) U12.A3(E:PE1_A3) U12.A4(E:PE0_A4) U12.A5(B:PB8_A5) U12.A6(B:PB5_A6) U12.A8(G:PG13_A8) U12.A9(B:PB4_A9) U12.A10(B:PB3_A10) U12.A11(D:PD7_A11) U12.A12(C:PC12_A12) U12.A13(A:PA15_A13) U12.B1(E:PE4_B1) U12.B2(E:PE5_B2) U12.B3(E:PE6_B3) U12.B4(B:PB9_B4) U12.B5(B:PB7_B5) U12.B7(G:PG15_B7) U12.B8(G:PG12_B8) U12.B9(G:PG11_B9) U12.B10(G:PG10_B10) U12.B11(D:PD6_B11) U12.B12(D:PD0_B12) U12.B13(C:PC11_B13) U12.B15(A:PA12_B15) U12.C4(I:PI5_C4) U12.C11(D:PD5_C11) U12.C12(D:PD1_C12) U12.C13(I:PI3_C13) U12.C14(I:PI2_C14) U12.C15(A:PA11_C15) U12.D1(C:PC13_D1) U12.D2(I:PI8_D2) U12.D3(I:PI9_D3) U12.D4(I:PI4_D4) U12.D10(D:PD4_D10) U12.D11(D:PD3_D11) U12.D12(D:PD2_D12) U12.D13(H:PH15_D13) U12.D14(I:PI1_D14) U12.D15(A:PA10_D15) U12.E1(C:PC14_E1) U12.E2(F:PF0_E2) U12.E3(I:PI10_E3) U12.E4(I:PI11_E4) U12.E12(H:PH13_E12) U12.E13(H:PH14_E13) U12.E14(I:PI0_E14) U12.E15(A:PA9_E15) U12.F1(C:PC15_F1) U12.F15(A:PA8_F15) U12.G14(C:PC8_G14) U12.G15(C:PC7_G15) U12.H1(H:PH1_H1) U12.H2(F:PF2_H2) U12.H3(F:PF1_H3) U12.H4(H:PH4_H4) U12.H14(G:PG8_H14) U12.H15(C:PC6_H15) U12.J2(F:PF3_J2) U12.J3(F:PF4_J3) U12.J4(H:PH5_J4) U12.K3(F:PF5_K3) U12.K12(H:PH12_K12) U12.K13(G:PG5_K13) U12.K14(G:PG4_K14) U12.K15(G:PG3_K15) U12.L1(F:PF10_L1) U12.L2(F:PF9_L2) U12.L3(F:PF8_L3) U12.L12(H:PH11_L12) U12.L13(H:PH10_L13) U12.L14(D:PD15_L14) U12.L15(G:PG2_L15) U12.M2(C:PC0_M2) U12.M3(C:PC1_M3) U12.M4(C:PC2_M4) U12.M5(C:PC3_M5) U12.M7(G:PG1_M7) U12.M11(H:PH6_M11) U12.M12(H:PH8_M12) U12.M13(H:PH9_M13) U12.M14(D:PD14_M14) U12.M15(D:PD13_M15) U12.N2(A:PA1_N2) U12.N3(A:PA0_N3) U12.N4(A:PA4_N4) U12.N5(C:PC4_N5) U12.N6(F:PF13_N6) U12.N7(G:PG0_N7) U12.N11(E:PE13_N11) U12.N12(H:PH7_N12) U12.N13(D:PD12_N13) U12.N14(D:PD11_N14) U12.N15(D:PD10_N15) U12.P2(A:PA2_P2) U12.P3(A:PA6_P3) U12.P4(A:PA5_P4) U12.P5(C:PC5_P5) U12.P6(F:PF12_P6) U12.P7(F:PF15_P7) U12.P8(E:PE8_P8) U12.P9(E:PE9_P9) U12.P10(E:PE11_P10) U12.P11(E:PE14_P11) U12.P12(B:PB12_P12) U12.P13(B:PB13_P13) U12.P14(D:PD9_P14) U12.P15(D:PD8_P15) U12.R2(A:PA3_R2) U12.R3(A:PA7_R3) U12.R4(B:PB1_R4) U12.R5(B:PB0_R5) U12.R6(F:PF11_R6) U12.R7(F:PF14_R7) U12.R8(E:PE7_R8) U12.R9(E:PE10_R9)

### Notes on the sheet
- ≤ 1%
- VDD Bypass Capacitors | VDDA Bypass Capacitors
- VDDUSB Bypass Capacitors

## Sheet 7 of 7: USB
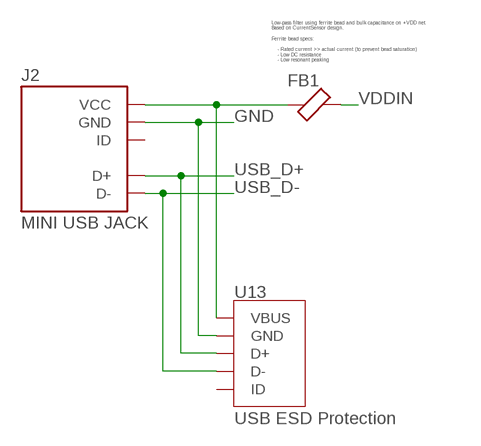
[diagram p6: schematic, sheet 7]

### Parts
FB1  FERRITE-BEAD0402  [0402]
J2  MINI-USB-JACK  [AMPHENOLFCI-10033526-N3222MLF]
U13  TI-TPD4S012DRYR  [TI-TPD4S012DRYR]

### Nets
GND: J2.GND J2.GND2(GND) J2.GND3(GND) J2.GND4(GND) J2.GND5(GND) U13.4(GND) ; also sheet 1,2,3,4,5,6
N$54: FB1.1 J2.VCC U13.6(VBUS)
USB_D+: J2.D+ U13.1(D+) ; also sheet 6
USB_D-: J2.D- U13.2(D-) ; also sheet 6
VDDIN: FB1.2 ; also sheet 1,6
Unconnected: J2.ID U13.3(ID)

### Notes on the sheet
- Low-pass filter using ferrite bead and bulk capacitance on +VDD net.
  Based on CurrentSensor design.
  
  Ferrite bead specs:
  
      - Rated current >> actual current (to prevent bead saturation)
      - Low DC resistance
      - Low resonant peaking

## Library data of the parts
C1-C10 C23 C26 C28 C30 C32 C34 C36 C38 C42 C43 C47 = EagleLibrary:CAPACITOR; MFG: KEMET; PN: C0805C106K8PACTU
C11 C13 C15 C17 C19 C21 C24 C27 C29 C31 C33 C35 C37 C39-C41 C44-C46 C48-C50 C52 C54-C57 C59-C62 C64-C69 = EagleLibrary:CAPACITOR; MFG: Murata; PN: GRM155R61H104KE19D
C12 C14 C16 C18 C20 C22 C25 C51 = EagleLibrary:CAPACITOR; MFG: Murata; PN: GCM155R71H103JA55D
C53 C70 C71 = EagleLibrary:CAPACITOR; MFG: AVX; PN: 0402ZD225MAT2A
C58 C63 = EagleLibrary:CAPACITOR; MFG: Taiyo Yuden; PN: EMK105BJ105MVHF
C72 = EagleLibrary:CAPACITOR; MFG: Taiyo Yuden; PN: LMK107BJ475KA-T
FB1 = EagleLibrary:FERRITE-BEAD; MFG: Taiyo Yuden; PN: BKP1005EM100-T
H1 = EagleLibrary:HEADER-2X5; MFG: TE Connectivity; PN: 1-2314844-0
J1 = EagleLibrary:S-MOUNT-LENS-HOLDER; MFG: Marshall Electronics; PN: V-LH4
J2 = EagleLibrary:MINI-USB-JACK: Mini USB Jack; MFG: Amphenol FCI; PN: 10033526-N3222MLF
L1-L3 = EagleLibrary:INDUCTOR; MFG: Murata; PN: DFE201612E-R47M=P2
LED1-LED8 = EagleLibrary:LED: LED; MFG: OSRAM; PN: KS DELLS1.22-JHKI-1
R1 R2 R4 = EagleLibrary:RESISTOR; MFG: Vishay; PN: CRCW08050000Z0EAC
R3 = EagleLibrary:RESISTOR; MFG: Vishay; PN: CRCW12061R00FKEA
R5 = EagleLibrary:RESISTOR; MFG: Bourns; PN: CR0402-FX-4223GLF
R6 R14-R16 R31 = EagleLibrary:RESISTOR; MFG: Vishay; PN: CRCW040210K0FKEDC
R7 = EagleLibrary:RESISTOR; MFG: Bourns; PN: CR0402-FX-9102GLF
R8-R11 R27-R30 = EagleLibrary:RESISTOR; MFG: TE Connectivity; PN: CRGP0402F1K8
R12 R13 = EagleLibrary:RESISTOR; MFG: Bourns; PN: CR0402AJW-101GAS
R17 = EagleLibrary:RESISTOR; MFG: Vishay; PN: CRCW04024K70FKEDC
R18-R26 = EagleLibrary:RESISTOR; MFG: Yageo; PN: RC0402FR-0756KL
R32 = EagleLibrary:RESISTOR; MFG: Yageo; PN: AC0402FR-073KL
TP1-TP10 = EagleLibrary:TEST-POINT: Bare copper test point
U1 = EagleLibrary:TI-TPS6280XYKAR: Step-Down Converter; MFG: Texas Instruments; PN: TPS62801YKAR
U2 = EagleLibrary:TI-TPS6280XYKAR: Step-Down Converter; MFG: Texas Instruments; PN: TPS62802YKAR
U3 = EagleLibrary:TI-TPS63805YFFR: Buck-Boost Converter; MFG: Texas Instruments; PN: TPS63805YFFR
U4 = EagleLibrary:LATTICE-ICE40HX4K-BG121: Lattice ICE40 FPGA; MFG: Lattice; PN: ICE40HX4K-BG121
U5 = EagleLibrary:ON-AR0330CS1C12SPKA0: 3.4 Megapixel CMOS Image Sensor; MFG: ON Semiconductor; PN: AR0330CS1C12SPKA0-CP2
U6 = EagleLibrary:W989D6DBGX6I: 512Mbit SDRAM; MFG: Winbond; PN: W989D6DBGX6I
U7 = EagleLibrary:NXP-NTB0102; MFG: NXP; PN: NTB0102GF,115
U8 U10 = EagleLibrary:ON-NLAS3157; MFG: ON Semiconductor; PN: NLAS3157MX3TCG
U9 = EagleLibrary:MICROSD-SOCKET: microSD Socket; MFG: Molex; PN: 105162-0001
U11 = EagleLibrary:TI-TMUX1574; MFG: Texas Instruments; PN: TMUX1574RSVR
U12 = EagleLibrary:STM-STM32F730; MFG: STMicroelectronics; PN: STM32F730I8K6
U13 = EagleLibrary:TI-TPD4S012DRYR: USB ESD diode; MFG: Texas Instruments; PN: TPD4S012DRYR
X1 X2 = EagleLibrary:SITIME-SIT8021: MEMS Oscillator; MFG: SiTime; PN: SIT8021AI-J4-18S-24.000000E